# EAGLE design relay (EAGLE 9.6.2)
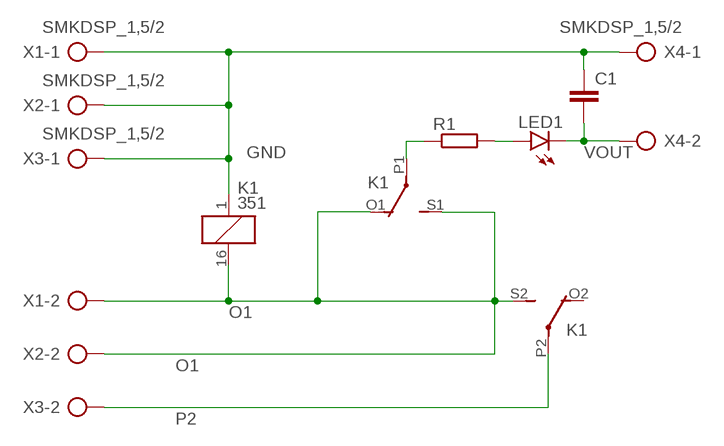
[diagram p0: schematic, sheet 1]

## Parts
C1  C-EU025-025X050  [C025-025X050]
K1  351  [351]
LED1  LED3MM  [LED3MM]
R1  R-EU_0207/10  [0207/10]
X1  SMKDSP_1,5/2  [SMKDSP_1,5/2]
X2  SMKDSP_1,5/2  [SMKDSP_1,5/2]
X3  SMKDSP_1,5/2  [SMKDSP_1,5/2]
X4  SMKDSP_1,5/2  [SMKDSP_1,5/2]

## Nets
GND: C1.1 K1.1 X1.1 X2.1 X3.1 X4.1
N$1: K1.P1(2:P) R1.1
N$2: LED1.A R1.2
O1: K1.16 K1.O1(2:O) K1.S1(2:S) K1.S2(3:S) X1.2 X2.2
P2: K1.P2(3:P) X3.2
VOUT: C1.2 LED1.K(C) X4.2
Unconnected: K1.O2(3:O)

## Library data of the parts
C1 = rcl:C-EU: CAPACITOR, European symbol; SPICEPREFIX: C
K1 = relay:351: RELAY 2 x switch, Omron; OC_FARNELL: unknown; OC_NEWARK: unknown
LED1 = led:LED: LED OSRAM: - CHIPLED LG R971, LG N971, LY N971, LG Q971, LY Q971, LO R971, LY R971 LH N974, LH R974 LS Q976, LO Q976, LY Q976 LO Q996 - Hyper CHIPLED LW Q18S LB Q993, LB Q99A, LB R99A - SideLED LS A670, LO A670, LY A670, LG A670, LP A670 LB A673, LV A673, LT A673, LW A673 LH A674 LY A675 LS A676, LA A676, LO A676, LY A676, LW A676 LS A679, LY A679, LG A679 - Hyper Micro SIDELED® LS Y876, LA Y876, LO Y876, LY Y876 LT Y87S - SmartLED LW L88C, LW L88S LB L89C, LB L89S, LG L890 LS L89K, LO L89K, LY L89K LS L896, LA L896, LO L896, LY L896 - TOPLED LS T670, LO T670, LY T670, LG T670, LP T670 LSG T670, LSP T670, LSY T670, LOP T670, LYG T670 LG T671, LOG T671, LSG T671 LB T673, LV T673, LT T673, LW T673 LH T674 LS T676, LA T676, LO T676, LY T676, LB T676, LH T676, LSB T676, LW T676 LB T67C, LV T67C, LT T67C, LS T67K, LO T67K, LY T67K, LW E67C LS E67B, LA E67B, LO E67B, LY E67B, LB E67C, LV E67C, LT E67C LW T67C LS T679, LY T679, LG T679 LS T770, LO T770, LY T770, LG T770, LP T770 LB T773, LV T773, LT T773, LW T773 LH T774 LS E675, LA E675, LY E675, LS T675 LS T776, LA T776, LO T776, LY T776, LB T776 LHGB T686 LT T68C, LB T68C - Hyper Mini TOPLED® LB M676 - Mini TOPLED Santana® LG M470 LS M47K, LO M47K, LY M47K Source: http://www.osram.convergy.de LUXEON: - LUMILED® LXK2-PW12-R00, LXK2-PW12-S00, LXK2-PW14-U00, LXK2-PW14-V00 LXK2-PM12-R00, LXK2-PM12-S00, LXK2-PM14-U00 LXK2-PE12-Q00, LXK2-PE12-R00, LXK2-PE12-S00, LXK2-PE14-T00, LXK2-PE14-U00 LXK2-PB12-K00, LXK2-PB12-L00, LXK2-PB12-M00, LXK2-PB14-N00, LXK2-PB14-P00, LXK2-PB14-Q00 LXK2-PR12-L00, LXK2-PR12-M00, LXK2-PR14-Q00, LXK2-PR14-R00 LXK2-PD12-Q00, LXK2-PD12-R00, LXK2-PD12-S00 LXK2-PH12-R00, LXK2-PH12-S00 LXK2-PL12-P00, LXK2-PL12-Q00, LXK2-PL12-R00 Source: www.luxeon.com KINGBRIGHT: KA-3528ASYC Source: www.kingbright.com
R1 = rcl:R-EU_: RESISTOR, European symbol; SPICEPREFIX: R
X1-X4 = con-phoenix-smkdsp:SMKDSP_1,5/2: Printklemme, Nennstrom: 17,5 A, Bemessungsspannung: 250 V, Raster: 5,0 mm Source: http://eshop.phoenixcontact.de .. 1733415.pdf; MF: FARNELL; MPN: 1733570; OC_FARNELL: 3041244; OC_NEWARK: 69C8588

## Board
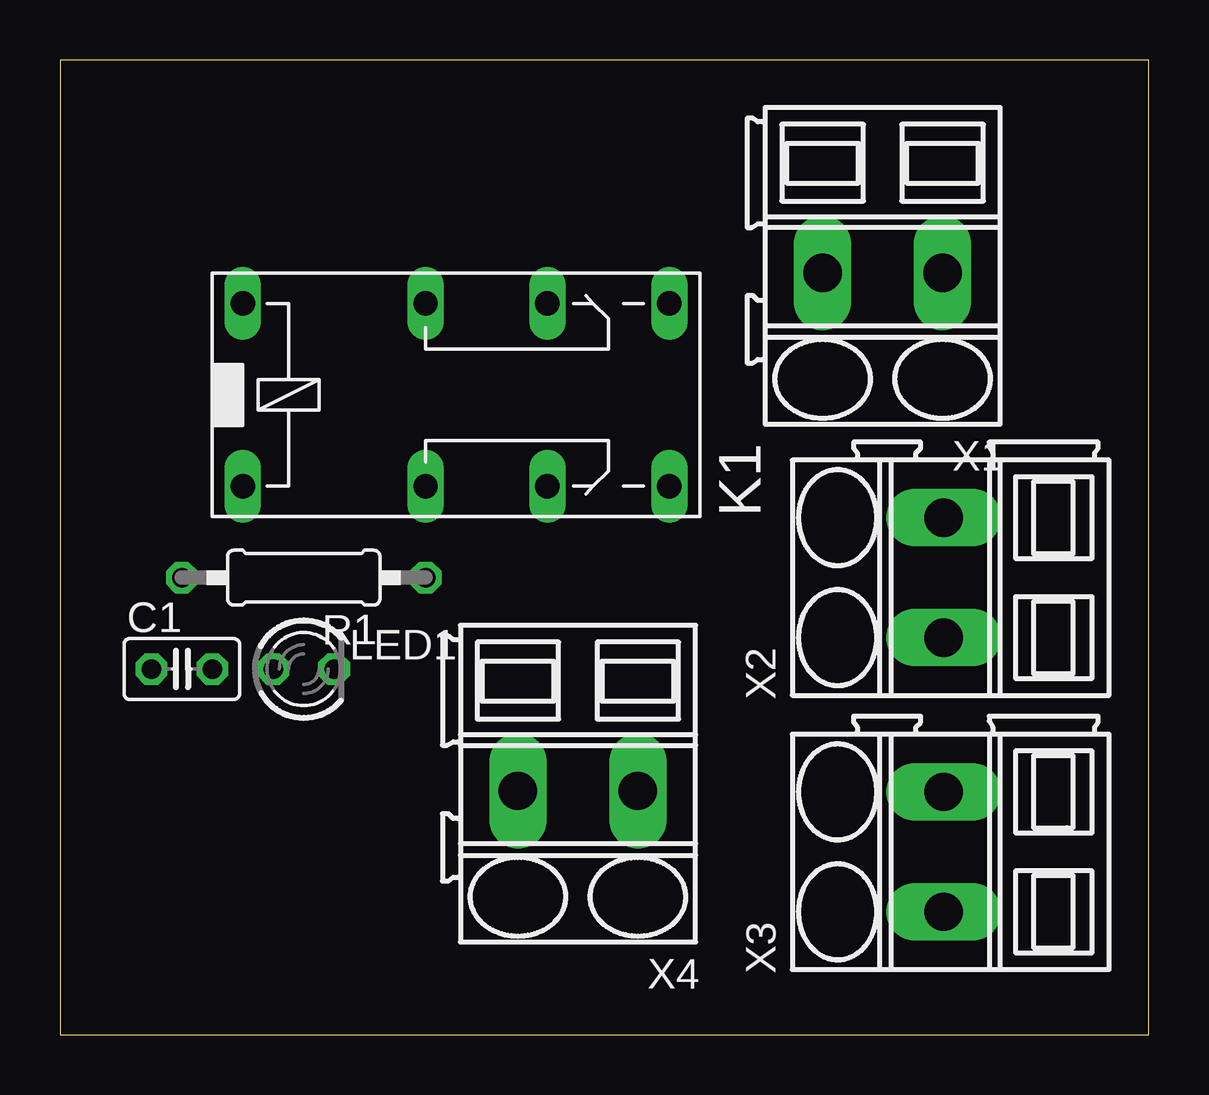
[diagram p1: board, top side]
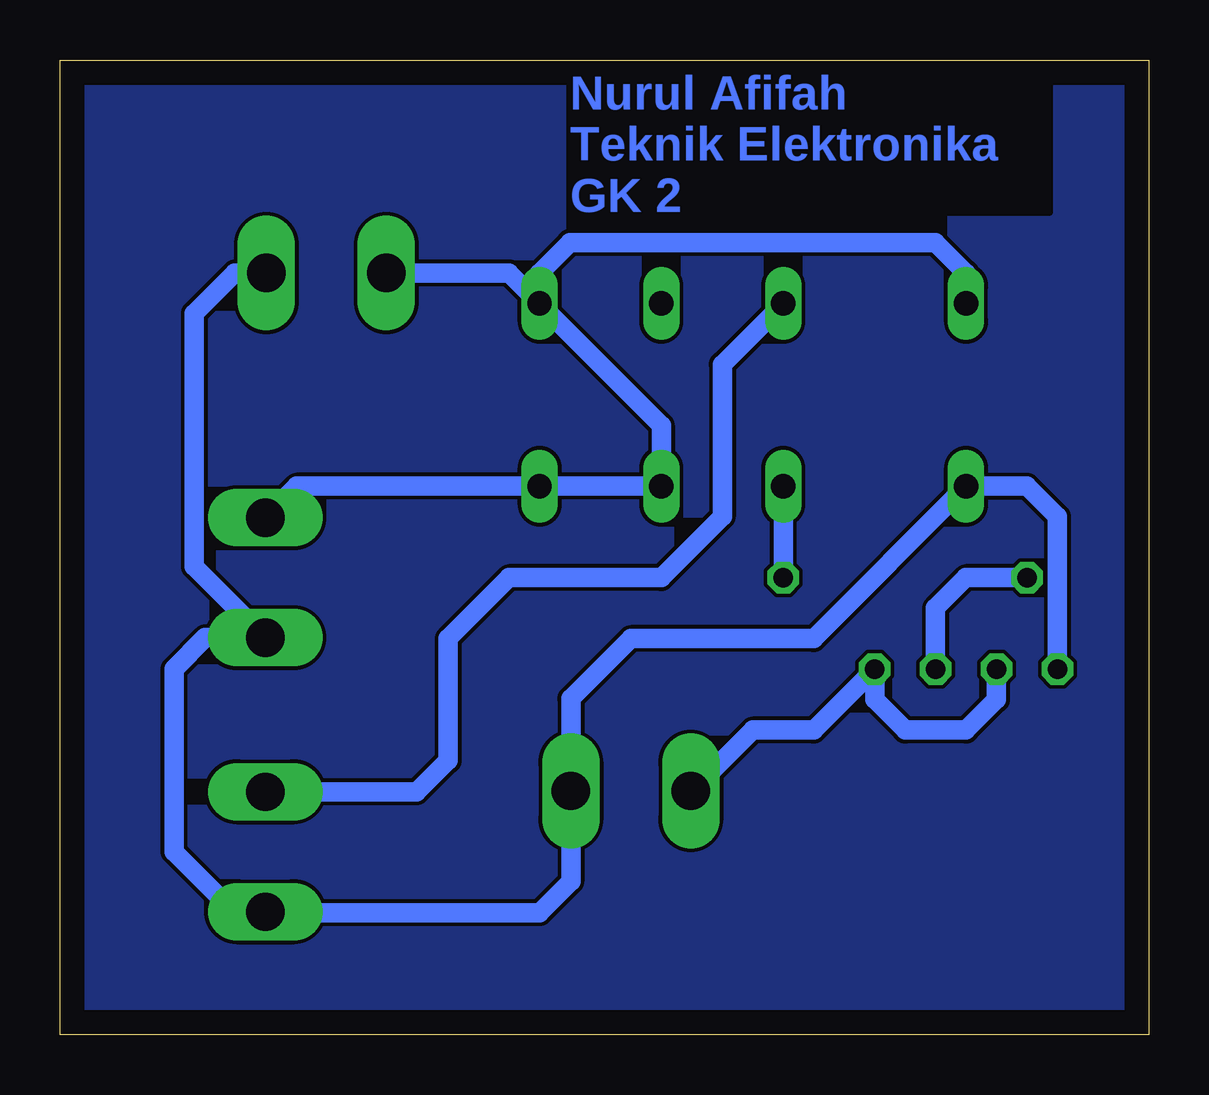
[diagram p2: board, bottom side, seen from below]

Size 45.39 x 40.63 mm. Coordinates in mm from the lower left corner, seen from the top.
Outline: 0,0 45.39,0 45.39,40.63 0,40.63 0,0
Copper layers (1*16): Top 0.035mm / dielectric 1.5mm / Bottom 0.035mm
Design rules "default": minimum track width 6mil, minimum drill 0.35mm, track to track 6mil, track to pad 6mil, pad to pad 6mil, via to via 6mil, smd to smd 6mil, copper to edge 40mil, drill to drill 6mil, minimum pad ring 10mil, minimum via ring 8mil, stop-mask expansion 4mil, vias tented up to drill 0mil, thermal gap 10mil

### Footprints (pad centres in the part's own frame; a part is rotated, then mirrored left to right if it is on the bottom)
C025-025X050 = drill 0.813 octagon: 1 -1.27,0; 2 1.27,0
351 = drill 1.016 long: 1 -3.81,-3.81; 16 -3.81,3.81; O1 8.89,-3.81; O2 8.89,3.81; P1 3.81,-3.81; P2 3.81,3.81; S1 13.97,-3.81; S2 13.97,3.81
LED3MM = drill 0.813 octagon: A -1.27,0; K 1.27,0
0207/10 = drill 0.813 octagon: 1 -5.08,0; 2 5.08,0
SMKDSP_1,5/2 = drill 1.6 pad 1.8 long: 1 -2.5,0; 2 2.5,0

### Placement (x,y rotation side)
C1  5.08,15.24 0 top
K1  11.43,26.67 0 top
LED1  10.16,15.24 0 top
R1  10.16,19.05 180 top
X1  34.29,31.75 180 top
X2  36.83,19.05 90 top
X3  36.83,7.62 90 top
X4  21.59,10.16 180 top

### Tracks (layer width: path | path; a pad name or v marks a point on that pad's centre or on a via)
GND
  Bottom 0.813: C1.1 3.81,21.59 5.08,22.86 K1.1 13.97,16.51 21.59,16.51 24.09,14.01 X4.1 24.09,6.39 25.4,5.08 36.79,5.08 X3.1 38.14,5.12 40.64,7.62 40.64,15.24 39.33,16.55 X2.1 39.79,19.51 39.79,30.06 38.1,31.75 X1.1
N$1
  Bottom 0.813: R1.1 K1.P1
N$2
  Bottom 0.813: R1.2 7.62,19.05 8.89,17.78 LED1.A
O1
  Bottom 0.813: X2.2 35.52,22.86 K1.S1 K1.O1 20.32,25.4 K1.S2 | K1.16 7.62,31.75 8.89,33.02 24.13,33.02 25.4,31.75 K1.S2 | K1.S2 26.67,31.75 X1.2
P2
  Bottom 0.813: K1.P2 17.78,27.94 17.78,21.59 20.32,19.05 26.67,19.05 29.21,16.51 29.21,11.43 30.52,10.12 X3.2
VOUT
  Bottom 0.813: C1.2 6.35,13.97 7.62,12.7 10.16,12.7 11.43,13.97 LED1.K 13.97,12.7 16.51,12.7 19.05,10.16 X4.2
YY
  pour Bottom: 0,40.64 45.72,40.64 45.72,0 0,0

### Text on the board
Bottom: Nurul Afifah / Teknik Elektronika / GK 2